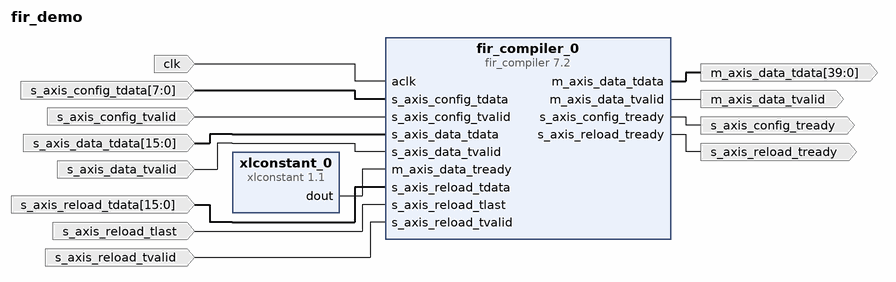
[diagram p0: block diagram of the top level]
# Vivado block design fir_demo, xc7z020clg400-1, Vivado 2023.2
create_bd_design fir_demo

create_bd_port -dir I -type clk clk
set_property -dict {CONFIG.FREQ_HZ 125000000} [get_bd_ports clk]
create_bd_port -dir I -from 15 -to 0 -type data s_axis_data_tdata
create_bd_port -dir I s_axis_data_tvalid
create_bd_port -dir O -from 39 -to 0 m_axis_data_tdata
create_bd_port -dir O m_axis_data_tvalid
create_bd_port -dir I -from 15 -to 0 s_axis_reload_tdata
create_bd_port -dir I s_axis_reload_tlast
create_bd_port -dir I s_axis_reload_tvalid
create_bd_port -dir O s_axis_reload_tready
create_bd_port -dir I -from 7 -to 0 s_axis_config_tdata
create_bd_port -dir O s_axis_config_tready
create_bd_port -dir I s_axis_config_tvalid

create_bd_cell -type ip -vlnv xilinx.com:ip:fir_compiler:7.2 fir_compiler_0
set_property -dict [list \
  CONFIG.CoefficientVector -10,0 \
  CONFIG.Coefficient_Fractional_Bits 0 \
  CONFIG.Coefficient_Reload true \
  CONFIG.Coefficient_Sets 1 \
  CONFIG.Coefficient_Sign Signed \
  CONFIG.Coefficient_Structure Inferred \
  CONFIG.Coefficient_Width 16 \
  CONFIG.M_DATA_Has_TREADY true \
  CONFIG.Output_Rounding_Mode Full_Precision \
  CONFIG.Output_Width 33 \
  CONFIG.Quantization Integer_Coefficients \
] [get_bd_cells fir_compiler_0]
create_bd_cell -type ip -vlnv xilinx.com:ip:xlconstant:1.1 xlconstant_0

# ---- connections ----

connect_bd_net [get_bd_ports clk] [get_bd_pins fir_compiler_0/aclk]
connect_bd_net [get_bd_pins fir_compiler_0/m_axis_data_tdata] [get_bd_ports m_axis_data_tdata]
connect_bd_net [get_bd_pins fir_compiler_0/m_axis_data_tvalid] [get_bd_ports m_axis_data_tvalid]
connect_bd_net [get_bd_pins fir_compiler_0/s_axis_config_tready] [get_bd_ports s_axis_config_tready]
connect_bd_net [get_bd_pins fir_compiler_0/s_axis_reload_tready] [get_bd_ports s_axis_reload_tready]
connect_bd_net [get_bd_ports s_axis_config_tdata] [get_bd_pins fir_compiler_0/s_axis_config_tdata]
connect_bd_net [get_bd_ports s_axis_config_tvalid] [get_bd_pins fir_compiler_0/s_axis_config_tvalid]
connect_bd_net [get_bd_ports s_axis_data_tdata] [get_bd_pins fir_compiler_0/s_axis_data_tdata]
connect_bd_net [get_bd_ports s_axis_data_tvalid] [get_bd_pins fir_compiler_0/s_axis_data_tvalid]
connect_bd_net [get_bd_ports s_axis_reload_tdata] [get_bd_pins fir_compiler_0/s_axis_reload_tdata]
connect_bd_net [get_bd_ports s_axis_reload_tlast] [get_bd_pins fir_compiler_0/s_axis_reload_tlast]
connect_bd_net [get_bd_ports s_axis_reload_tvalid] [get_bd_pins fir_compiler_0/s_axis_reload_tvalid]
connect_bd_net [get_bd_pins xlconstant_0/dout] [get_bd_pins fir_compiler_0/m_axis_data_tready]

validate_bd_design
save_bd_design
